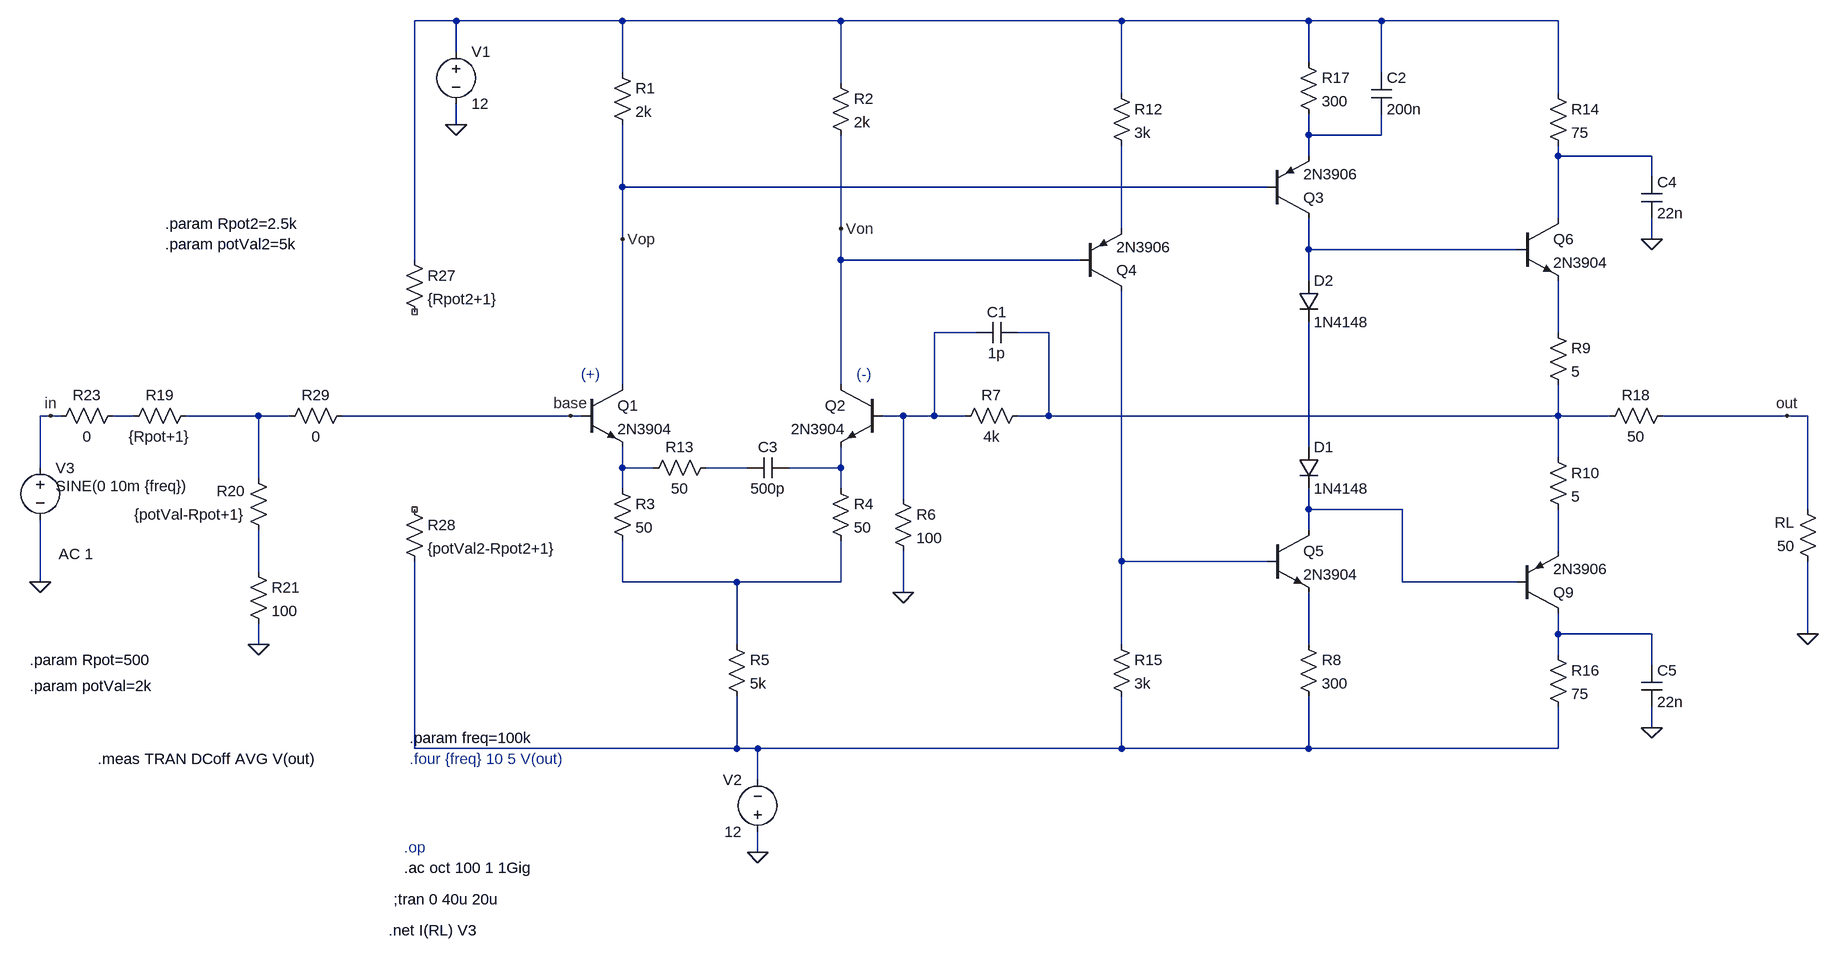
[diagram p0: schematic output amplifier.asc]
output amplifier.asc, the LTspice schematic file:
Version 4
SHEET 1 1924 1096
WIRE -208 -384 -272 -384
WIRE 48 -384 -208 -384
WIRE 384 -384 48 -384
WIRE 816 -384 384 -384
WIRE 1104 -384 816 -384
WIRE 1216 -384 1104 -384
WIRE 1488 -384 1216 -384
WIRE -208 -336 -208 -384
WIRE 1104 -320 1104 -384
WIRE 48 -304 48 -384
WIRE 1216 -304 1216 -384
WIRE 384 -288 384 -384
WIRE 816 -272 816 -384
WIRE 1488 -272 1488 -384
WIRE -208 -224 -208 -256
WIRE 1104 -208 1104 -240
WIRE 1216 -208 1216 -240
WIRE 1216 -208 1104 -208
WIRE 1104 -176 1104 -208
WIRE 1488 -176 1488 -192
WIRE 1632 -176 1488 -176
WIRE 1632 -144 1632 -176
WIRE 48 -128 48 -224
WIRE 1040 -128 48 -128
WIRE 1488 -80 1488 -176
WIRE 384 -64 384 -208
WIRE 816 -64 816 -192
WIRE 48 -48 48 -128
WIRE 1632 -48 1632 -80
WIRE 1104 -32 1104 -80
WIRE 1424 -32 1104 -32
WIRE -272 -16 -272 -384
WIRE 384 -16 384 -64
WIRE 752 -16 384 -16
WIRE 1104 16 1104 -32
WIRE 592 96 528 96
WIRE 704 96 656 96
WIRE 1488 96 1488 16
WIRE 48 176 48 -48
WIRE 384 176 384 -16
WIRE -832 224 -848 224
WIRE -816 224 -832 224
WIRE -704 224 -736 224
WIRE -512 224 -624 224
WIRE -464 224 -512 224
WIRE -32 224 -384 224
WIRE -16 224 -32 224
WIRE 480 224 448 224
WIRE 528 224 528 96
WIRE 528 224 480 224
WIRE 576 224 528 224
WIRE 704 224 704 96
WIRE 704 224 656 224
WIRE 1488 224 1488 176
WIRE 1488 224 704 224
WIRE 1568 224 1488 224
WIRE 1840 224 1648 224
WIRE 1872 224 1840 224
WIRE 1104 272 1104 80
WIRE 1488 288 1488 224
WIRE -848 304 -848 224
WIRE 48 304 48 272
WIRE 96 304 48 304
WIRE 240 304 176 304
WIRE 384 304 384 272
WIRE 384 304 304 304
WIRE -512 320 -512 224
WIRE 48 336 48 304
WIRE 384 336 384 304
WIRE 480 352 480 224
WIRE 1104 368 1104 336
WIRE 1248 368 1104 368
WIRE 1872 368 1872 224
WIRE 1104 400 1104 368
WIRE 1488 432 1488 368
WIRE 816 448 816 32
WIRE 1040 448 816 448
WIRE -512 464 -512 400
WIRE -848 480 -848 384
WIRE 48 480 48 416
WIRE 224 480 48 480
WIRE 384 480 384 416
WIRE 384 480 224 480
WIRE 1248 480 1248 368
WIRE 1424 480 1248 480
WIRE 480 496 480 432
WIRE 1488 560 1488 528
WIRE 1632 560 1488 560
WIRE 1872 560 1872 448
WIRE -512 576 -512 544
WIRE 224 576 224 480
WIRE 816 576 816 448
WIRE 1104 576 1104 496
WIRE 1488 592 1488 560
WIRE 1632 608 1632 560
WIRE 1632 704 1632 672
WIRE -272 736 -272 448
WIRE 224 736 224 656
WIRE 224 736 -272 736
WIRE 256 736 224 736
WIRE 816 736 816 656
WIRE 816 736 256 736
WIRE 1104 736 1104 656
WIRE 1104 736 816 736
WIRE 1488 736 1488 672
WIRE 1488 736 1104 736
WIRE 256 784 256 736
WIRE 256 896 256 864
FLAG -208 -224 0
FLAG 256 896 0
FLAG -848 480 0
FLAG 1840 224 out
FLAG -832 224 in
FLAG 480 496 0
FLAG 1872 560 0
FLAG 1632 -48 0
FLAG 1632 704 0
FLAG 48 -48 Vop
FLAG 384 -64 Von
FLAG -512 576 0
FLAG -32 224 base
SYMBOL res 32 -320 R0
SYMATTR InstName R1
SYMATTR Value 2k
SYMBOL res 368 -304 R0
SYMATTR InstName R2
SYMATTR Value 2k
SYMBOL res 32 320 R0
SYMATTR InstName R3
SYMATTR Value 50
SYMBOL res 368 320 R0
SYMATTR InstName R4
SYMATTR Value 50
SYMBOL npn -16 176 R0
SYMATTR InstName Q1
SYMATTR Value 2N3904
SYMBOL res 208 560 R0
SYMATTR InstName R5
SYMATTR Value 5k
SYMBOL npn 448 176 M0
SYMATTR InstName Q2
SYMATTR Value 2N3904
SYMBOL res 464 336 R0
SYMATTR InstName R6
SYMATTR Value 100
SYMBOL res 672 208 R90
WINDOW 0 0 56 VBottom 2
WINDOW 3 32 56 VTop 2
SYMATTR InstName R7
SYMATTR Value 4k
SYMBOL npn 1424 -80 R0
SYMATTR InstName Q6
SYMATTR Value 2N3904
SYMBOL pnp 1424 528 M180
SYMATTR InstName Q9
SYMATTR Value 2N3906
SYMBOL res 1888 464 R180
WINDOW 0 36 76 Left 2
WINDOW 3 36 40 Left 2
SYMATTR InstName RL
SYMATTR Value 50
SYMBOL voltage -208 -352 R0
WINDOW 123 0 0 Left 0
WINDOW 39 0 0 Left 0
SYMATTR InstName V1
SYMATTR Value 12
SYMBOL voltage 256 880 R180
WINDOW 0 24 96 Left 2
WINDOW 3 24 16 Left 2
WINDOW 123 0 0 Left 0
WINDOW 39 0 0 Left 0
SYMATTR InstName V2
SYMATTR Value 12
SYMBOL voltage -848 288 R0
WINDOW 3 24 44 Left 2
WINDOW 123 28 149 Left 2
WINDOW 39 0 0 Left 0
SYMATTR Value SINE(0 10m {freq})
SYMATTR Value2 AC 1
SYMATTR InstName V3
SYMBOL pnp 1040 -80 M180
SYMATTR InstName Q3
SYMATTR Value 2N3906
SYMBOL diode 1088 272 R0
SYMATTR InstName D1
SYMATTR Value 1N4148
SYMBOL diode 1088 16 R0
SYMATTR InstName D2
SYMATTR Value 1N4148
SYMBOL res 1472 576 R0
SYMATTR InstName R16
SYMATTR Value 75
SYMBOL res 1472 -288 R0
SYMATTR InstName R14
SYMATTR Value 75
SYMBOL cap 656 80 R90
WINDOW 0 0 32 VBottom 2
WINDOW 3 32 32 VTop 2
SYMATTR InstName C1
SYMATTR Value 1p
SYMBOL cap 1616 -144 R0
SYMATTR InstName C4
SYMATTR Value 22n
SYMBOL cap 1616 608 R0
SYMATTR InstName C5
SYMATTR Value 22n
SYMBOL res 800 -288 R0
SYMATTR InstName R12
SYMATTR Value 3k
SYMBOL res 800 560 R0
SYMATTR InstName R15
SYMATTR Value 3k
SYMBOL npn 1040 400 R0
SYMATTR InstName Q5
SYMATTR Value 2N3904
SYMBOL pnp 752 32 M180
SYMATTR InstName Q4
SYMATTR Value 2N3906
SYMBOL res 1472 80 R0
SYMATTR InstName R9
SYMATTR Value 5
SYMBOL res 1472 272 R0
SYMATTR InstName R10
SYMATTR Value 5
SYMBOL res 1088 560 R0
SYMATTR InstName R8
SYMATTR Value 300
SYMBOL res 1088 -336 R0
SYMATTR InstName R17
SYMATTR Value 300
SYMBOL cap 1200 -304 R0
SYMATTR InstName C2
SYMATTR Value 200n
SYMBOL res 1664 208 R90
WINDOW 0 0 56 VBottom 2
WINDOW 3 32 56 VTop 2
SYMATTR InstName R18
SYMATTR Value 50
SYMBOL res -608 208 R90
WINDOW 0 0 56 VBottom 2
WINDOW 3 32 56 VTop 2
SYMATTR InstName R19
SYMATTR Value {Rpot+1}
SYMBOL res -496 416 R180
WINDOW 0 36 76 Left 2
WINDOW 3 36 40 Left 2
SYMATTR InstName R20
SYMATTR Value {potVal-Rpot+1}
SYMBOL res 192 288 R90
WINDOW 0 0 56 VBottom 2
WINDOW 3 32 56 VTop 2
SYMATTR InstName R13
SYMATTR Value 50
SYMBOL cap 304 288 R90
WINDOW 0 0 32 VBottom 2
WINDOW 3 32 32 VTop 2
SYMATTR InstName C3
SYMATTR Value 500p
SYMBOL res -528 448 R0
SYMATTR InstName R21
SYMATTR Value 100
SYMBOL res -720 208 R90
WINDOW 0 0 56 VBottom 2
WINDOW 3 32 56 VTop 2
SYMATTR InstName R23
SYMATTR Value 0
SYMBOL res -288 -32 R0
SYMATTR InstName R27
SYMATTR Value {Rpot2+1}
SYMBOL res -288 352 R0
SYMATTR InstName R28
SYMATTR Value {potVal2-Rpot2+1}
SYMBOL res -368 208 R90
WINDOW 0 0 56 VBottom 2
WINDOW 3 32 56 VTop 2
SYMATTR InstName R29
SYMATTR Value 0
TEXT -288 920 Left 2 !.ac oct 100 1 1Gig
TEXT -16 160 Left 2 ;(+)
TEXT 408 160 Left 2 ;(-)
TEXT -304 968 Left 2 !;tran 0 40u 20u
TEXT -288 888 Left 2 ;.op
TEXT -312 1016 Left 2 !.net I(RL) V3
TEXT -280 720 Left 2 !.param freq=100k
TEXT -280 752 Left 2 ;.four {freq} 10 5 V(out)
TEXT -864 600 Left 2 !.param Rpot=500
TEXT -864 640 Left 2 !.param potVal=2k
TEXT -760 752 Left 2 !.meas TRAN DCoff AVG V(out)
TEXT -656 -72 Left 2 !.param Rpot2=2.5k
TEXT -656 -40 Left 2 !.param potVal2=5k

The netlist it stands for:
* output amplifier.asc
R1 N001 Vop 2k
R2 N001 Von 2k
R3 N012 N019 50
R4 N014 N019 50
Q1 Vop base N012 0 2N3904
R5 N019 N022 5k
Q2 Von N006 N014 0 2N3904
R6 N006 0 100
R7 N007 N006 4k
Q6 N003 N005 N008 0 2N3904
Q9 N020 N015 N016 0 2N3906
RL 0 out 50
V1 N001 0 12
V2 0 N022 12
V3 in 0 SINE(0 10m {freq}) AC 1
Q3 N005 Vop N002 0 2N3906
D1 N011 N015 1N4148
D2 N005 N011 1N4148
R16 N020 N022 75
R14 N001 N003 75
C1 N007 N006 1p
C4 N003 0 22n
C5 N020 0 22n
R12 N001 N004 3k
R15 N017 N022 3k
Q5 N015 N017 N021 0 2N3904
Q4 N017 Von N004 0 2N3906
R9 N008 N007 5
R10 N007 N016 5
R8 N021 N022 300
R17 N001 N002 300
C2 N001 N002 200n
R18 out N007 50
R19 N010 N009 {Rpot+1}
R20 N018 N010 {potVal-Rpot+1}
R13 N013 N012 50
C3 N014 N013 500p
R21 N018 0 100
R23 N009 in 0
R27 N001 NC_01 {Rpot2+1}
R28 NC_02 N022 {potVal2-Rpot2+1}
R29 base N010 0
.model D D
.lib standard.dio
.model NPN NPN
.model PNP PNP
.lib standard.bjt
.ac oct 100 1 1Gig
* (+)
* (-)
;tran 0 40u 20u
* .op
.net I(RL) V3
.param freq=100k
* .four {freq} 10 5 V(out)
.param Rpot=500
.param potVal=2k
.meas TRAN DCoff AVG V(out)
.param Rpot2=2.5k
.param potVal2=5k
.backanno
.end